# EAGLE design ODGIRON-v1.0-F4x1-0410 (EAGLE 9.6.0)
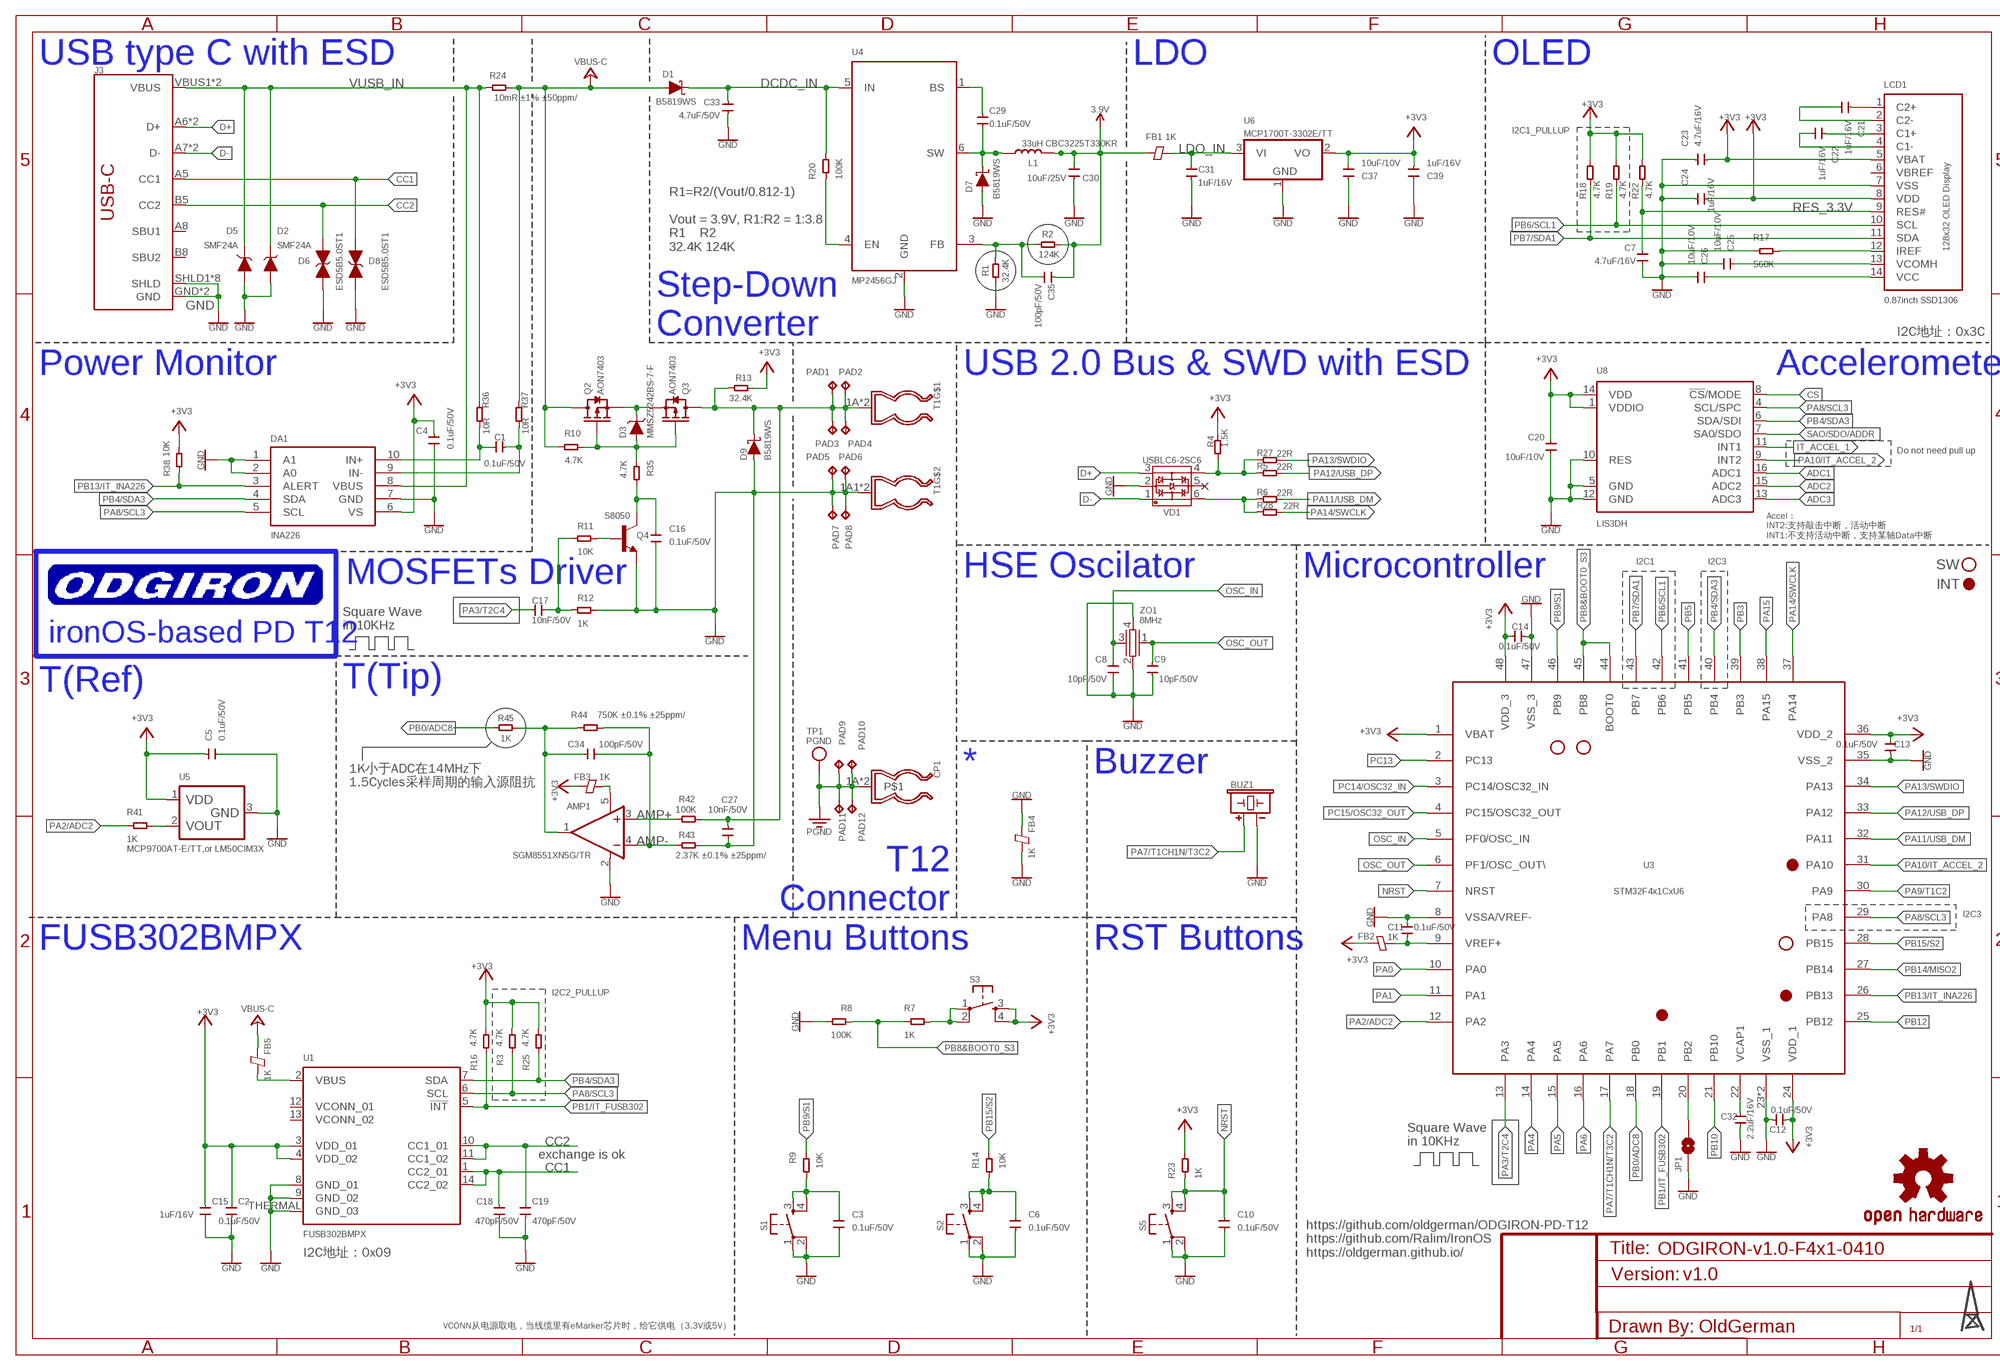
[diagram p0: schematic, sheet 1, part 1 of 2]
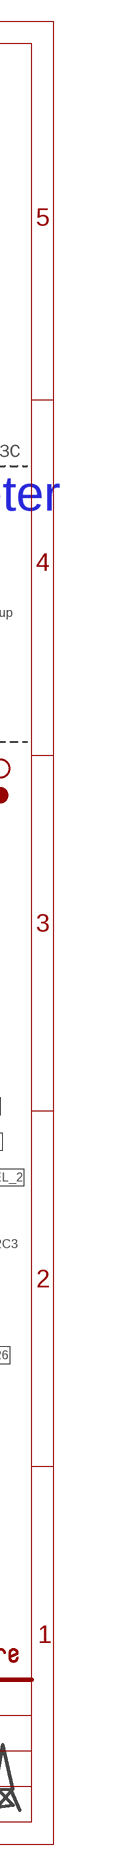
[diagram p1: schematic, sheet 1, part 2 of 2]

## Parts
AMP1  SGM8551XN5G/TR  AMP_SIMGLEN  [SOT23-5]
BUZ1  BUZZERBUZZER_5020  [BUZZER_5020]
C1  0.1uF/50V  SEEED_CAP-0603  [C0603]
C2  0.1uF/50V  SEEED_CAP-0603  [C0603]
C3  0.1uF/50V  SEEED_CAP-0603  [C0603]
C4  0.1uF/50V  SEEED_CAP-0603  [C0603]
C5  0.1uF/50V  SEEED_CAP-0603  [C0603]
C6  0.1uF/50V  SEEED_CAP-0603  [C0603]
C7  4.7uF/16V  SEEED_CAP-0603  [C0603]
C8  10pF/50V  SEEED_CAP-0603  [C0603]
C9  10pF/50V  SEEED_CAP-0603  [C0603]
C10  0.1uF/50V  SEEED_CAP-0603  [C0603]
C11  0.1uF/50V  SEEED_CAP-0603  [C0603]
C12  0.1uF/50V  SEEED_CAP-0603  [C0603]
C13  0.1uF/50V  SEEED_CAP-0603  [C0603]
C14  0.1uF/50V  SEEED_CAP-0603  [C0603]
C15  1uF/16V  SEEED_CAP-0603  [C0603]
C16  0.1uF/50V  SEEED_CAP-0603  [C0603]
C17  10nF/50V  SEEED_CAP-0603  [C0603]
C18  470pF/50V  SEEED_CAP-0603  [C0603]
C19  470pF/50V  SEEED_CAP-0603  [C0603]
C20  10uF/10V  SEEED_CAP-0603  [C0603]
C21  1uF/16V  SEEED_CAP-0603  [C0603]
C22  1uF/16V  SEEED_CAP-0603  [C0603]
C23  4.7uF/16V  SEEED_CAP-0603  [C0603]
C24  1uF/16V  SEEED_CAP-0603  [C0603]
C25  10uF/10V  SEEED_CAP-0603  [C0603]
C26  10uF/10V  SEEED_CAP-0603  [C0603]
C27  10nF/50V  SEEED_CAP-0603  [C0603]
C29  0.1uF/50V  SEEED_CAP-0603  [C0603]
C30  10uF/25V  SEEED_CAP-0805  [C0805]
C31  1uF/16V  SEEED_CAP-0603  [C0603]
C32  2.2uF/16V  SEEED_CAP-0603  [C0603]
C33  4.7uF/50V  SEEED_CAP-0805  [C0805]
C34  100pF/50V  SEEED_CAP-0603  [C0603]
C35  100pF/50V  SEEED_CAP-0603  [C0603]
C37  10uF/10V  SEEED_CAP-0603  [C0603]
C39  1uF/16V  SEEED_CAP-0603  [C0603]
CP1  FUSE_CLIPS_01  [FUSE_CLIPS_01]
D1  B5819WS  DIODE_SCHOTTKYSOD323  [SOD-323]
D2  SMF24A  DIODE-TVS_UNIDIRECTIONALSOD-123  [SOD-123]
D3  MMSZ5242BS-7-F  DIODE_ZENERSOD-323  [SOD-323]
D5  SMF24A  DIODE-TVS_UNIDIRECTIONALSOD-123  [SOD-123]
D6  ESD5B5.0ST1  DIODE-TVS_BI−DIRECTIONALSOD-523  [SOD-523]
D7  B5819WS  DIODE_SCHOTTKYSOD323  [SOD-323]
D8  ESD5B5.0ST1  DIODE-TVS_BI−DIRECTIONALSOD-523  [SOD-523]
D9  B5819WS  DIODE_SCHOTTKYSOD323  [SOD-323]
DA1  INA226  [MSOP10]
FB1  1K  FERRITE-BEAD-0603  [F0603]
FB2  1K  FERRITE-BEAD-0603  [F0603]
FB3  1K  FERRITE-BEAD-0603  [F0603]
FB4  1K  FERRITE-BEAD-0603  [F0603]
FB5  1K  FERRITE-BEAD-0603  [F0603]
J3  USB_C_LONG-SYMBOL2-LAYER  [USB-C-16P]
JP1  JUMPER-SMT_2_NO_SILK  [SMT-JUMPER_2_NO_SILK]
L1  33uH CBC3225T330KR  INDUCTOR3225  [SMD,3.2X2.5X2.5MM]
LCD1  0.87inch SSD1306  0.87INCH_OLED_128X32_SSD1306  [0.87INCH_128X32_OLED_SSD1306]
LOGO1  OSHW-LOGONO_SILK  [DUMMY]
PAD1  PADTP16SQ  [TP16SQ]
PAD2  PADTP16SQ  [TP16SQ]
PAD3  PADTP16SQ  [TP16SQ]
PAD4  PADTP16SQ  [TP16SQ]
PAD5  PADTP16SQ  [TP16SQ]
PAD6  PADTP16SQ  [TP16SQ]
PAD7  PADTP16SQ  [TP16SQ]
PAD8  PADTP16SQ  [TP16SQ]
PAD9  PADTP16SQ  [TP16SQ]
PAD10  PADTP16SQ  [TP16SQ]
PAD11  PADTP16SQ  [TP16SQ]
PAD12  PADTP16SQ  [TP16SQ]
Q2  AON7403  MOSFET-P-AON7403  [DFN8P-0.65-3X3X0.8MM]
Q3  AON7403  MOSFET-P-AON7403  [DFN8P-0.65-3X3X0.8MM]
Q4  S8050  TRANS_NPN-MMBT2222AL  [SOT23-3]
R1  32.4K  SEEED_RES-0603  [R0603]
R2  124K  SEEED_RES-0603  [R0603]
R3  4.7K  SEEED_RES-0603  [R0603]
R4  1.5K  SEEED_RES-0603  [R0603]
R5  22R  SEEED_RES-0603  [R0603]
R6  22R  SEEED_RES-0603  [R0603]
R7  1K  SEEED_RES-0603  [R0603]
R8  100K  SEEED_RES-0603  [R0603]
R9  10K  SEEED_RES-0603  [R0603]
R10  4.7K  SEEED_RES-0603  [R0603]
R11  10K  SEEED_RES-0603  [R0603]
R12  1K  SEEED_RES-0603  [R0603]
R13  32.4K  SEEED_RES-0603  [R0603]
R14  10K  SEEED_RES-0603  [R0603]
R16  4.7K  SEEED_RES-0603  [R0603]
R17  560K  SEEED_RES-0603  [R0603]
R18  4.7K  SEEED_RES-0603  [R0603]
R19  4.7K  SEEED_RES-0603  [R0603]
R20  100K  SEEED_RES-0603  [R0603]
R22  4.7K  SEEED_RES-0603  [R0603]
R23  1K  SEEED_RES-0603  [R0603]
R24  10mR ±1% ±50ppm/℃  SEEED_RES-1206  [R1206]
R25  4.7K  SEEED_RES-0603  [R0603]
R27  22R  SEEED_RES-0603  [R0603]
R28  22R  SEEED_RES-0603  [R0603]
R35  4.7K  SEEED_RES-0603  [R0603]
R36  10R  SEEED_RES-0603  [R0603]
R37  10R  SEEED_RES-0603  [R0603]
R38  10K  SEEED_RES-0603  [R0603]
R41  1K  SEEED_RES-0603  [R0603]
R42  100K  SEEED_RES-0603  [R0603]
R43  2.37K ±0.1% ±25ppm/℃  SEEED_RES-0603  [R0603]
R44  750K ±0.1% ±25ppm/℃  SEEED_RES-0603  [R0603]
R45  1K  SEEED_RES-0603  [R0603]
S1  TAC_SWITCHSMD  [TACTILE_SWITCH_SMD]
S2  TAC_SWITCHSMD  [TACTILE_SWITCH_SMD]
S3  TAC_SWITCHSMD  [TACTILE_SWITCH_SMD]
S5  TAC_SWITCHSMD  [TACTILE_SWITCH_SMD]
T1  HAKKO_T12_K-TYPE_WITH_FUSE_CLIPS_X2  [HAKKO_T12_K-TYPE_WITH_FUSE_CLIPS_X2]
TP1  PGND  TESTPOINTROUND2MM  [TESTPOINT_ROUND_2MM]
U1  FUSB302BMPX  FUSB302  [QFN14-2.5X2.5MM]
U3  STM32F4x1CxU6  STM32F4_QFN48  [QFN48_7X7MM_0.5MM]
U4  MP2456GJ  MP2456  [SOT23-6]
U5  MCP9700AT-E/TT,or LM50CIM3X  MCP9700  [SOT23-3@1]
U6  MCP1700T-3302E/TT  MCP1700  [SOT23-3]
U8  LIS3DH  [LGA-16-3X3]
VD1  USBLC6-2SC6  USBLC6-2SOT23-6  [SOT23-6]
ZO1  8MHz  3225_CRYSTALL  [3.2X2.5_KX-7]

## Nets
3.9V: C30.1 C35.1 FB1.1 L1.2 R2.1
+3V3: C2.1 C4.1 C5.1 C12.2 C13.2 C14.2 C15.1 C20.2 C23.2 C24.2 C37.2 C39.2 DA1.6(VS) FB2.2 FB3.2 LCD1.5(VBAT) LCD1.8(VDD) R3.1 R4.2 R13.2 R16.1 R18.2 R19.2 R22.2 R23.2 R25.1 R38.1 S3.3 S3.4 U1.3(VDD_01) U1.4(VDD_02) U3.1(VBAT) U3.24(VDD_1) U3.36(VDD_2) U3.48(VDD_3) U5.1(VDD) U6.2(VO) U8.1(VDDIO) U8.14(VDD)
ADC1: U8.16(ADC1)
ADC2: U8.15(ADC2)
ADC3: U8.13(ADC3)
AMP+: AMP1.3(+IN) R42.1
AMP-: AMP1.4(-IN) C34.2 R43.1 R44.2
BS: C29.1 U4.1(BS)
CC1: C18.1 D8.K(C) J3.A5(CC1) U1.1(CC2_01) U1.14(CC2_02)
CC2: C19.1 D6.K(C) J3.B5(CC2) U1.10(CC1_01) U1.11(CC1_02)
CS: U8.8(!CS!/MODE)
D+: J3.A6(D+) J3.B6(D+) VD1.3
D-: J3.A7(D-) J3.B7(D-) VD1.1
DCDC_IN: C33.1 D1.C R20.2 U4.5(IN)
EN: R20.1 U4.4(EN)
GND: AMP1.2(V-) BUZ1.-(LEAD-) C2.2 C3.2 C4.2 C5.2 C6.2 C7.2 C8.1 C9.1 C10.2 C11.1 C12.1 C13.1 C14.1 C15.2 C16.1 C18.2 C19.2 C20.1 C23.1 C24.1 C25.2 C26.2 C27.2 C30.2 C31.1 C32.2 C33.2 C37.1 C39.1 D2.A D5.A D6.A D7.A D8.A D9.A DA1.1(A1) DA1.2(A0) DA1.7(GND) FB4.1 FB4.2 J3.GND J3.GND2(GND) J3.SHLD1(SHLD) J3.SHLD2(SHLD) J3.SHLD3(SHLD) J3.SHLD4(SHLD) J3.SHLD5(SHLD) J3.SHLD6(SHLD) J3.SHLD7(SHLD) J3.SHLD8(SHLD) JP1.1 LCD1.7(VSS) PAD5.TP PAD6.TP PAD7.TP PAD8.TP Q4.2(E) R1.1 R8.2 R12.1 R17.1 R43.2 S1.1 S1.2 S2.1 S2.2 S5.1 S5.2 T1.1A1 T1.1B1 U1.8(GND_01) U1.9(GND_02) U1.THERMAL(GND_03) U3.8(VSSA/VREF-) U3.23(VSS_1) U3.35(VSS_2) U3.47(VSS_3) U3.P$1(VSS_1) U4.2(GND) U5.3(GND) U6.1(GND) U8.5(GND) U8.10(RES) U8.12(GND) VD1.2 ZO1.2 ZO1.4
IT_ACCEL_1: U8.11(INT1)
LDO_IN: C31.2 FB1.2 U6.3(VI)
N$1: R4.1 R5.1 R27.1 VD1.4
N$2: R7.2 S3.1 S3.2
N$3: D3.C Q2.1(S) Q2.2(S) Q2.3(S) Q3.1(S) Q3.2(S) Q3.3(S)
N$4: C21.1 LCD1.1(C2+)
N$5: D3.A Q2.4(G) Q3.4(G) R10.2 R35.1
N$6: C22.1 LCD1.3(C1+)
N$7: C11.2 FB2.1 U3.9(VREF+)
N$8: C3.1 R9.2 S1.3 S1.4
N$11: C21.2 LCD1.2(C2-)
N$12: C6.1 R14.2 S2.3 S2.4
N$13: C22.2 LCD1.4(C1-)
N$14: C25.1 LCD1.13(VCOMH)
N$15: LCD1.12(IREF) R17.2
N$16: C26.1 LCD1.14(VCC)
N$17: Q4.1(B) R11.1
N$18: C35.2 R1.2 R2.2 U4.3(FB)
N$19: C16.2 Q4.3(C) R35.2
N$20: C17.1 R11.2 R12.2
N$21: AMP1.5(V+) FB3.1
N$22: R6.1 R28.1 VD1.6
N$23: FB5.1 U1.2(VBUS)
N$24: JP1.2 U3.20(PB2)
N$30: C1.1 DA1.10(IN+) R36.1
N$32: C1.2 DA1.9(IN-) R37.1
N$35: R41.2 U5.2(VOUT)
NRST: C10.1 R23.1 S5.3 S5.4 U3.7(NRST)
OSC_IN: C8.2 U3.5(PF0/OSC_IN) ZO1.3
OSC_OUT: C9.2 U3.6(PF1/OSC_OUT\) ZO1.1
OUT: AMP1.1(OUT) C34.1 R44.1 R45.2
PA0: U3.10(PA0)
PA1: U3.11(PA1)
PA2/ADC2: R41.1 U3.12(PA2)
PA3/T2C4: C17.2 U3.13(PA3)
PA4: U3.14(PA4)
PA5: U3.15(PA5)
PA6: U3.16(PA6)
PA7/T1CH1N/T3C2: BUZ1.+(LEAD+) U3.17(PA7)
PA8/SCL3: DA1.5(SCL) R3.2 U1.6(SCL) U3.29(PA8) U8.4(SCL/SPC)
PA9/T1C2: U3.30(PA9)
PA10/IT_ACCEL_2: U3.31(PA10) U8.9(INT2)
PA11/USB_DM: R6.2 U3.32(PA11)
PA12/USB_DP: R5.2 U3.33(PA12)
PA13/SWDIO: R27.2 U3.34(PA13)
PA14/SWCLK: R28.2 U3.37(PA14)
PA15: U3.38(PA15)
PB0/ADC8: R45.1 U3.18(PB0)
PB1/IT_FUSB302: R16.2 U1.5(!INT) U3.19(PB1)
PB3: U3.39(PB3)
PB4/SDA3: DA1.4(SDA) R25.2 U1.7(SDA) U3.40(PB4) U8.6(SDA/SDI)
PB5: U3.41(PB5)
PB6/SCL1: LCD1.10(SCL) R19.1 U3.42(PB6)
PB7/SDA1: LCD1.11(SDA) R18.1 U3.43(PB7)
PB8&BOOT0_S3: R7.1 R8.1 U3.44(BOOT0) U3.45(PB8)
PB9/S1: R9.1 U3.46(PB9)
PB10: U3.21(PB10)
PB12: U3.25(PB12)
PB13/IT_INA226: DA1.3(ALERT) R38.2 U3.26(PB13)
PB14/MISO2: U3.27(PB14)
PB15/S2: R14.1 U3.28(PB15)
PC13: U3.2(PC13)
PC14/OSC32_IN: U3.3(PC14/OSC32_IN)
PC15/OSC32_OUT: U3.4(PC15/OSC32_OUT)
PGND: CP1.1A CP1.1B PAD9.TP PAD10.TP PAD11.TP PAD12.TP TP1.P$1
RES_3.3V: C7.1 LCD1.9(RES#) R22.1
SAO/SDO/ADDR: U8.7(SA0/SDO)
SW: C29.2 D7.C L1.1 U4.6(SW)
T12+: C27.1 D9.C PAD1.TP PAD2.TP PAD3.TP PAD4.TP Q3.5(D) Q3.6(D) Q3.7(D) Q3.8(D) Q3.9(D) R13.1 R42.2 T1.1A T1.1B
VBUS-C: D1.A FB5.2 Q2.5(D) Q2.6(D) Q2.7(D) Q2.8(D) Q2.9(D) R10.1 R24.1 R37.2
VCAP1: C32.1 U3.22(VCAP1)
VUSB_IN: D2.C(K) D5.C(K) DA1.8(VBUS) J3.VBUS1(VBUS) J3.VBUS2(VBUS) R24.2 R36.2
Unconnected: J3.A8(SBU1) J3.B8(SBU2) U1.12(VCONN_01) U1.13(VCONN_02) VD1.5

## Notes on the sheet
- USB type C with ESD | LDO | OLED
- I2C1_PULLUP
- R1=R2/(Vout/0.812-1)
  
  Vout = 3.9V, R1:R2 = 1:3.8
  R1    R2
  32.4K 124K
- Step-Down
  Converter
- I2C地址：0x3C
- Power Monitor | USB 2.0 Bus & SWD with ESD | Accelerometer
- Do not need pull up
- Accel：
  INT2:支持敲击中断，活动中断
  INT1:不支持活动中断，支持某轴Data中断
- I2C1 | I2C3 | SW
- MOSFETs Driver | HSE Oscilator | Microcontroller
- INT
- Square Wave
  in 10KHz
- ironOS-based PD T12
- T(Ref) | T(Tip)
- * | Buzzer
- 1K小于ADC在14MHz下
  1.5Cycles采样周期的输入源阻抗
- T12
  Connector
- I2C3
- FUSB302BMPX | Menu Buttons | RST Buttons
- I2C2_PULLUP
- Square Wave
  in 10KHz
- exchange is ok
- FUSB302 | ACCEL+2 | SW | SW | ACCEL_1 | INA226 | SW
- I2C地址：0x09
- https://github.com/oldgerman/ODGIRON-PD-T12
  https://github.com/Ralim/IronOS
  https://oldgerman.github.io/
- F103C8,F411: 0, 1, 2, 3, 4, 5-9, 10-15
  F072:0-1, 2-3, 4-15
- v1.0
- FUSB302 | ACCEL_2 | SW | SW | ACCEL_1 | INA226 | SW
- OldGerman
- VCONN从电源取电，当线缆里有eMarker芯片时，给它供电（3.3V或5V）

## Power pins joined to a net without a drawn wire
VBREF: LCD1.6(VBREF)

## Library data of the parts
AMP1 = TS100:AMP_SIMGLE: Rail-to-Rail Operational Amplifiers Single-Supply, MicroAmplifier(TM) Series; MPN: OPA340NA/3KG4; OC_FARNELL: 1234805; OC_NEWARK: 13M5177
BUZ1 = TS100:BUZZER
C1-C27 C29-C35 C37 C39 = TS100:SEEED_CAP: Ceramic Capacitors
CP1 = TS100:FUSE_CLIPS_01: FUSE 5 x 20 mm
D1 D7 D9 = TS100:DIODE_SCHOTTKY
D2 D5 = TS100:DIODE-TVS_UNIDIRECTIONAL
D3 = TS100:DIODE_ZENER
D6 D8 = TS100:DIODE-TVS_BI−DIRECTIONAL
DA1 = TS100:INA226: Lithium-Polymer/Lithium-Ion Battery Charger [Part No.] Microchip MCP73833 MSOP10 (tube only): Digikey: MCP73833T-AMI/UN or MCP73833-FCI/UN-ND Mouser: 579-MCP73833-AMI/UN DFN10 (tape): Digikey: Note Chips ending in 'AMI' have no timer, and chips ending in 'FCI' have a 6-hour timer that will end the charge sequence after 6 horus regqrdless of current charge level.
FB1-FB5 = TS100:FERRITE-BEAD
J3 = FUSB302:USB_C_LONG-SYMBOL: USB Type C 16Pin Connector Super Speed pins not available on the 16-pin purely SMD connector so this part is best for USB 2.0 implementations. D1 and D2 are tied together enabling D+/- no matter which way the cable is plugged into the connector. The two channel configuration pins (CC1/2) are exposed. These are normally connected to ground via 5.1k resistors but can be reconfigured for high current/high power applications.; PROD_ID: CONN-14122
JP1 = TS100:JUMPER-SMT_2_NO: Normally open jumper This jumper has two pads in close proximity to each other. Apply solder to close the connection. Round pads are easier to solder for beginners, but are a lot larger. SparkFun Product that uses the round pads: SparkFun EL Sequencer <https://www.sparkfun.com/products/12781>
L1 = TS100:INDUCTOR
LCD1 = TS100:0.87INCH_OLED_128X32_SSD1306: 128x32 I2C 0.91" Monochrome OLED Display
LOGO1 = SparkFun-Aesthetics:OSHW-LOGO: Open-Source Hardware (OSHW) Logo This logo indicates the piece of hardware it is found on incorporates a OSHW license and/or adheres to the definition of open source hardware found here: http://freedomdefined.org/OSHW
PAD1-PAD12 = TS100:PAD: Test pad
Q2 Q3 = TS100:MOSFET-P
Q4 = SparkFun-DiscreteSemi:TRANS_NPN: NPN transistor Current controlled devices typically used to amplify current or used as a switch. BC547 - COM-08928 <http://www.sparkfun.com/products/8928> (TO-92 45V 100mA) (1.Collector 2.Base 3.Emitter) 2N3904 - COM-00521 <http://www.sparkfun.com/products/521> (TO-92 40V 200mA) (1.Emitter 2.Base 3.Collector) P2N2222A - COM-12852 <http://www.sparkfun.com/products/12852> (TO-92 40V 600mA) (1.Collector 2.Base 3.Emitter); PROD_ID: TRANS-08049; VALUE: 600mA/40V
R1-R14 R16-R20 R22-R25 R27 R28 R35-R38 R41-R45 = TS100:SEEED_RES
S1-S3 = TS100:TAC_SWITCH: Momentary Switch Button commonly used for reset or general input. Spark Fun Electronics SKU : COM-00097
S5 = untitled:TAC_SWITCH: Momentary Switch Button commonly used for reset or general input. Spark Fun Electronics SKU : COM-00097
T1 = T12_FUSE_CLIPS:HAKKO_T12_K-TYPE_WITH_FUSE_CLIPS_X2
TP1 = microbuilder:TESTPOINT: Test Point Various test points for characterisation and PCB testing TESTPOINT_SMT - Compact Surface Mount Test Point [Digikey: 5016KTR-ND]
U1 = FUSB302:FUSB302: Espressif ESP8266 WiFi/Microcontroller SoC The ESP8266 WiFi Module is a self contained SOC with integrated TCP/IP protocol stack that can give any microcontroller access to your WiFi network. The ESP8266 is capable of either hosting an application or offloading all Wi-Fi networking functions from another application processor. SparkFun Products WiFi Module ESP8266 <https://www.sparkfun.com/products/13678> (WRL-13678) SparkFun ESP8266 Thing <https://www.sparkfun.com/products/13231> (WRL-13231) SparkFun WiFi Shield - ESP8266 <https://www.sparkfun.com/products/13287> (WRL-13287) SparkFun ESP8266 Thing - Dev Board <https://www.sparkfun.com/products/13711> (WRL-13711) SparkFun Blynk Board - ESP8266 <https://www.sparkfun.com/products/13794> (WRL-13794); PROD_ID: IC-12452
U3 = STM32:STM32F4_QFN48
U4 = TS100:MP2456
U5 = TS100:MCP9700
U6 = TS100:MCP1700
U8 = SparkFun-Sensors:LIS3DH: ST Microelectronics LIS3DH 3-Axis ±2/4/8/16g SPI/I2C Accelerometer The LIS3DH is a three axis MEMS linear accelerometer in the "nano" family. It has a digital I2C/SPI serial interface which makes it ideal for using in embedded applications. The device also features ultra low-power operational modes that allow advanced power saving and smart sleep to wake-up functions, built in detections with interrupts, and auxiliary ADC inputs Datasheet-XXXX <http://www.sparkfun.com/datasheets/Sensors/Accelerometer/LIS3DH.pdf> SparkFun Products SparkFun Triple Axis Accelerometer Breakout - LIS3DH <https://www.sparkfun.com/products/10345> (SEN-XXXXX) Triple Axis Accelerometer - LIS3DH <https://www.sparkfun.com/products/9755> (SEN-XXXXX); PROD_ID: IC-13419; SF_ID: N/A
VD1 = ESD-protection:USBLC6-2
ZO1 = DIP:3225_CRYSTALL

## Board
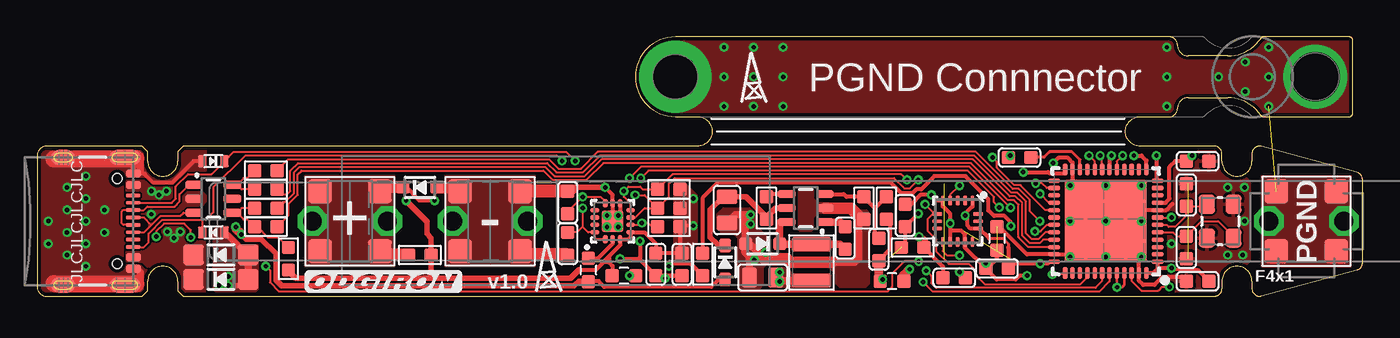
[diagram p2: board, top side]
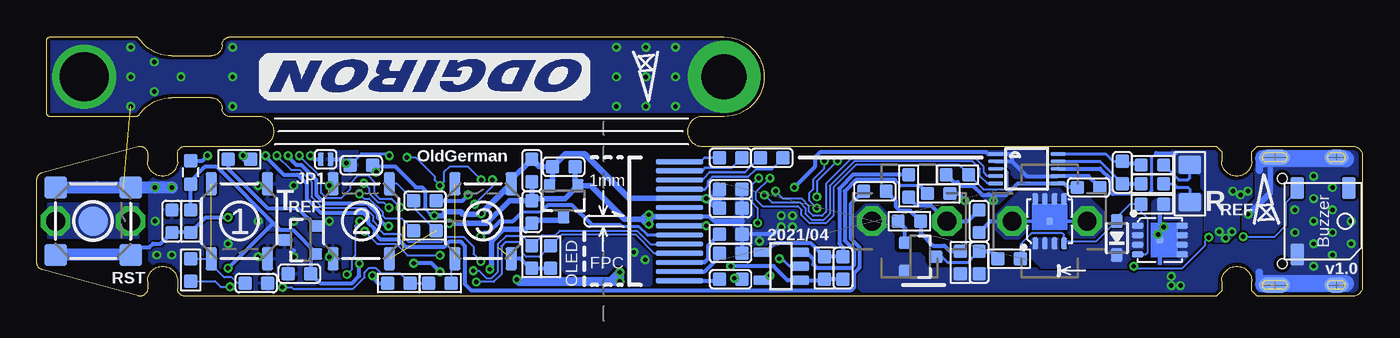
[diagram p3: board, bottom side, seen from below]

Size 89.79 x 17.56 mm. Coordinates in mm from the lower left corner, seen from the top.
Outline: 9.53,9.78 9.53,9.14 arc-180 7.49,9.14 7.49,9.78 7.11,10.16 0.64,10.16 arc90 0,9.52 0,0.63 arc90 0.64,0 7.11,0 7.49,0.38 7.49,1.02 arc-180 9.53,1.02 9.53,0.38 9.91,0 79.76,0 arc90 80.26,0.51 80.26,1.02 arc-180 82.3,1.02 82.3,0.51 arc105 82.94,0.02 89.41,1.78 arc75 89.79,2.29 89.79,7.87 arc75 89.41,8.38 82.94,10.14 arc105 82.3,9.65 82.3,9.14 arc-180 80.26,9.14 80.26,9.65 arc90 79.76,10.16 74.73,10.16 arc-90 73.73,11.16 arc-90 74.73,12.16 76.7,12.16 arc90 77.25,12.71 arc-90 78,13.45 80.67,13.45 arc-56 82.88,12.27 arc56 83.09,12.16 88.88,12.16 arc90 89.13,12.41 89.13,17.31 arc90 88.88,17.56 83.09,17.56 arc56 82.88,17.45 arc-56 80.67,16.27 78,16.27 arc-90 77.25,17.01 arc90 76.7,17.56 43.23,17.56 arc180 43.23,12.16 44.73,12.16 arc-90 45.73,11.16 arc-90 44.73,10.16 9.91,10.16 9.53,9.78
Copper layers (1*16): Top 0.035mm / dielectric 1.5mm / Bottom 0.035mm
Design rules "default *": minimum track width 5mil, minimum drill 0.3mm, track to track 5mil, track to pad 6mil, pad to pad 6mil, via to via 6mil, smd to smd 5mil, copper to edge 10mil, drill to drill 10mil, minimum pad ring 10mil, minimum via ring 6mil, stop-mask expansion 1mil, vias tented up to drill 20mil, thermal gap 8mil
tRestrict: 9 lines
bRestrict: 7 lines

### Footprints (pad centres in the part's own frame; a part is rotated, then mirrored left to right if it is on the bottom)
SOT23-5 = smd 0.6 x 1.2: 1 -0.95,-1.306; 2 0,-1.306; 3 0.95,-1.306; 4 0.95,1.306; 5 -0.95,1.306
BUZZER_5020 = smd 1.5 x 0.9: + -2.25,-1.75; - 2.25,-1.75; NC -2.25,1.75
C0603 = smd 0.889 x 0.889: 1 -0.762,0; 2 0.762,0
C0805 = smd 1.016 x 1.397: 1 -0.889,0; 2 0.889,0
FUSE_CLIPS_01 = drill 1.27 pad 2 octagon: 1A -2.54,0; 1B 2.54,0
SOD-323 = smd 0.9 x 0.8: A 1.15,0; C -1.15,0
SOD-123 = smd 1.4 x 1.4: A 1.85,0; C -1.85,0
SOD-523 = smd 0.8 x 0.6: A 0,-0.75; K 0,0.75
MSOP10 = smd 0.25 x 1: 1 -1,-2.113; 2 -0.5,-2.113; 3 0,-2.113; 4 0.5,-2.113; 5 1,-2.113; 6 1,2.113; 7 0.5,2.113; 8 0,2.113; 9 -0.5,2.113; 10 -1,2.113
F0603 = smd 0.889 x 0.889: 1 -0.8,0; 2 0.8,0
USB-C-16P = smd 0.28 x 1: A5 -1.25,-0.34; A6 -0.25,-0.34; A7 0.25,-0.34; A8 1.25,-0.34; B5 1.75,-0.34; B6 0.75,-0.34; B7 -0.75,-0.34; B8 -1.75,-0.34 | smd 0.56 x 1: GND -3.225,-0.34; GND2 3.225,-0.34; VBUS1 -2.45,-0.34; VBUS2 2.45,-0.34 | smd 1 x 2.1: SHLD1 -4.32,-0.915; SHLD2 4.32,-0.915 | smd 1 x 2.1 bottom: SHLD3 -4.32,-0.915; SHLD4 4.32,-0.915 | smd 1 x 1.6: SHLD5 -4.32,-5.095; SHLD8 4.32,-5.095 | smd 1 x 1.6 bottom: SHLD6 -4.32,-5.095; SHLD7 4.32,-5.095 | hole 0.65: -2.89,-1.445; 2.89,-1.445
SMT-JUMPER_2_NO_SILK = smd 0.406 x 0.889: 1 -0.33,0; 2 0.33,0
SMD,3.2X2.5X2.5MM = smd 0.95 x 2.7: 1 1.225,0; 2 -1.225,0
0.87INCH_128X32_OLED_SSD1306 = smd 3.2 x 0.35: 1 -2.888,-4.03; 2 -2.888,-3.41; 3 -2.888,-2.79; 4 -2.888,-2.17; 5 -2.888,-1.55; 6 -2.888,-0.93; 7 -2.888,-0.31; 8 -2.888,0.31; 9 -2.888,0.93; 10 -2.888,1.55; 11 -2.888,2.17; 12 -2.888,2.79; 13 -2.888,3.41; 14 -2.888,4.03
TP16SQ = smd 1.6 x 1.6: TP 0,0
DFN8P-0.65-3X3X0.8MM = smd 0.8 x 0.4: 1 -1.5,0.975; 2 -1.5,0.325; 3 -1.5,-0.325; 4 -1.5,-0.975; 5 1.5,-0.975; 6 1.5,-0.325; 7 1.5,0.325; 8 1.5,0.975 | smd 0.508 x 0.508: 9 0,0
SOT23-3 = smd 0.8 x 0.9: 1 -0.95,-1; 2 0.95,-1; 3 0,1.1
R0603 = smd 0.889 x 0.889: 1 -0.762,0; 2 0.762,0
R1206 = smd 1.27 x 1.524: 1 -1.27,0; 2 1.27,0
TACTILE_SWITCH_SMD = smd 1.524 x 0.762: 1 -2.54,1.905; 2 2.54,1.905; 3 -2.54,-1.905; 4 2.54,-1.905
TACTILE_SWITCH_SMD' = smd 1.524 x 1.524: 1 -2.54,2.286; 2 2.54,2.286; 3 -2.54,-2.286; 4 2.54,-2.286
HAKKO_T12_K-TYPE_WITH_FUSE_CLIPS_X2 = drill 1.27 pad 2 octagon: 1A 6.96,0; 1A1 16.46,0; 1B 12.04,0; 1B1 21.54,0
TESTPOINT_ROUND_2MM = smd 2 x 2: P$1 0,0
QFN14-2.5X2.5MM = smd 0.58 x 0.3: 1 -1.215,0.5; 2 -1.215,0; 3 -1.215,-0.5; 8 1.215,-0.5; 9 1.215,0; 10 1.215,0.5 | smd 0.3 x 0.58: 4 -0.75,-1.215; 5 -0.25,-1.215; 6 0.25,-1.215; 7 0.75,-1.215; 11 0.75,1.215; 12 0.25,1.215; 13 -0.25,1.215; 14 -0.75,1.215 | smd 1.45 x 1.45: THERMAL 0,0
QFN48_7X7MM_0.5MM = smd 0.8 x 0.3: 1 -3.5,2.75; 2 -3.5,2.25; 3 -3.5,1.75; 4 -3.5,1.25; 5 -3.5,0.75; 6 -3.5,0.25; 7 -3.5,-0.25; 8 -3.5,-0.75; 9 -3.5,-1.25; 10 -3.5,-1.75; 11 -3.5,-2.25; 12 -3.5,-2.75; 25 3.5,-2.75; 26 3.5,-2.25; 27 3.5,-1.75; 28 3.5,-1.25; 29 3.5,-0.75; 30 3.5,-0.25; 31 3.5,0.25; 32 3.5,0.75; 33 3.5,1.25; 34 3.5,1.75; 35 3.5,2.25; 36 3.5,2.75 | smd 0.3 x 0.8: 13 -2.75,-3.5; 14 -2.25,-3.5; 15 -1.75,-3.5; 16 -1.25,-3.5; 17 -0.75,-3.5; 18 -0.25,-3.5; 19 0.25,-3.5; 20 0.75,-3.5; 21 1.25,-3.5; 22 1.75,-3.5; 23 2.25,-3.5; 24 2.75,-3.5; 37 2.75,3.5; 38 2.25,3.5; 39 1.75,3.5; 40 1.25,3.5; 41 0.75,3.5; 42 0.25,3.5; 43 -0.25,3.5; 44 -0.75,3.5; 45 -1.25,3.5; 46 -1.75,3.5; 47 -2.25,3.5; 48 -2.75,3.5 | smd 5.6 x 5.6: P$1 0,0
SOT23-6 = smd 0.55 x 1.2: 1 0.95,1.3; 2 0,1.3; 3 -0.95,1.3; 4 -0.95,-1.3; 5 0,-1.3; 6 0.95,-1.3
SOT23-3@1 = smd 0.8 x 0.9: 1 -0.95,-1; 2 0.95,-1; 3 0,1.1
LGA-16-3X3 = smd 0.7 x 0.28: 1 -1.4,1; 2 -1.4,0.5; 3 -1.4,0; 4 -1.4,-0.5; 5 -1.4,-1; 9 1.4,-1; 10 1.4,-0.5; 11 1.4,0; 12 1.4,0.5; 13 1.4,1 | smd 0.28 x 0.7: 6 -0.5,-1.4; 7 0,-1.4; 8 0.5,-1.4; 14 0.5,1.4; 15 0,1.4; 16 -0.5,1.4
3.2X2.5_KX-7 = smd 1.3 x 1.1: 1 -1.15,-0.9; 2 1.15,-0.9; 3 1.15,0.9; 4 -1.15,0.9

### Placement (x,y rotation side)
AMP1  39.37,2.03 90 bottom
BUZ1  2.67,5.08 270 bottom
C1  16.26,8.38 270 bottom
C2  41.91,2.16 270 top
C3  74.93,0.89 0 bottom
C4  18.54,7.37 0 bottom
C5  72.01,1.52 180 bottom
C6  63.5,6.48 0 bottom
C7  62.13,1.24 0 top
C8  77.85,3.3 90 top
C9  77.85,6.86 270 top
C10  80.65,5.08 90 bottom
C11  78.61,9.14 180 top
C12  67.82,8.86 0 bottom
C13  65.02,1.88 0 top
C14  78.61,1.02 0 top
C15  43.69,2.16 270 top
C16  25.96,2.29 90 bottom
C17  33.02,7.11 180 bottom
C18  35.94,3.56 270 top
C19  35.94,6.35 90 top
C20  58.8,5.46 270 top
C21  42.8,9.37 0 bottom
C22  40,9.37 0 bottom
C23  42.8,7.24 180 bottom
C24  42.8,5.97 180 bottom
C25  42.8,2.92 0 bottom
C26  42.8,1.14 0 bottom
C27  25.96,5.08 90 bottom
C29  54.74,3.94 270 top
C30  49.15,1.27 180 top
C31  56.26,5.72 270 bottom
C32  66.55,9.4 180 top
C33  46.74,5.84 270 top
C34  35.18,1.91 90 bottom
C35  57.02,3.17 90 top
C37  56.26,8.51 90 bottom
C39  54.1,8.76 180 bottom
CP1  85.98,5.08 0 top
D1  46.61,2.29 270 top
D2  12.45,1.14 0 top
D3  16.64,3.94 90 bottom
D5  12.45,2.79 0 top
D6  11.94,4.32 90 top
D7  49.15,3.56 180 top
D8  11.94,9.14 270 top
D9  25.93,7.37 0 top
DA1  22.73,8.64 270 bottom
FB1  57.91,1.02 0 top
FB2  79.38,8.38 270 bottom
FB3  39.75,1.4 180 top
FB4  65.02,3.91 90 top
FB5  37.34,1.78 270 top
J3  6.86,5.08 270 top
JP1  70.23,9.27 180 bottom
L1  52.45,2.29 90 top
LCD1  49.15,5.08 180 bottom
LOGO1  -0.38,-1.14 0 top
PAD1  19.18,7.11 0 top
PAD2  23.22,7.11 0 top
PAD3  19.18,3.05 0 top
PAD4  23.22,3.05 0 top
PAD5  28.65,7.11 0 top
PAD6  28.65,3.05 0 top
PAD7  32.72,7.11 0 top
PAD8  32.72,3.05 0 top
PAD9  88.01,3.05 0 top
PAD10  83.95,7.11 0 top
PAD11  83.95,3.05 0 top
PAD12  88.01,7.11 0 top
Q2  13.72,3.81 0 bottom
Q3  21.18,5.08 90 bottom
Q4  29.97,2.67 270 bottom
R1  56.01,5.97 90 top
R2  57.53,5.97 90 top
R3  42.8,5.97 180 top
R4  17.02,2.54 270 top
R5  15.49,5.97 0 top
R6  15.49,7.24 0 top
R7  62.48,0.89 0 bottom
R8  65.28,0.89 180 bottom
R9  79.38,1.78 90 bottom
R10  14.22,6.22 180 bottom
R11  30.68,5.08 0 bottom
R12  27.23,2.29 90 bottom
R13  25.93,2.79 0 top
R14  63.5,4.45 0 bottom
R16  42.8,4.7 180 top
R17  42.8,4.19 180 bottom
R18  54.99,2.67 270 bottom
R19  56.26,2.67 270 bottom
R20  49.4,5.97 270 top
R22  59.31,3.3 180 top
R23  79.38,5.08 90 bottom
R24  11.68,7.62 90 bottom
R25  42.8,7.24 180 top
R27  15.49,4.7 0 top
R28  15.49,8.51 0 top
R35  23.93,2.54 180 bottom
R36  14.22,8.89 0 bottom
R37  14.22,7.62 0 bottom
R38  27.43,8.23 0 bottom
R41  76.07,9.27 180 bottom
R42  28.7,6.96 0 bottom
R43  30.73,7.47 270 bottom
R44  36.45,1.91 90 bottom
R45  45.08,2.16 270 top
S1  76.07,5.08 270 bottom
S2  67.82,5.08 90 bottom
S3  59.56,5.08 90 bottom
S5  [TACTILE_SWITCH_SMD']  85.98,5.08 0 bottom
T1  11.68,5.08 0 top
TP1  85.98,5.08 0 bottom
U1  38.99,5.08 90 top
U3  72.39,5.08 180 top
U4  52.07,5.97 270 top
U5  71.91,3.81 90 bottom
U6  54.1,6.48 180 bottom
U8  62.36,5.08 270 top
U$3  [CREATIVE_COMMONS]  21.21,-10.29 0 top  (outside the outline)
VD1  11.94,6.6 90 top
ZO1  80.14,5.08 270 top

### Tracks (layer width: path | path; a pad name or v marks a point on that pad's centre or on a via)
3.9V  (via drill 0.3)
  Top 0.152: C30.1 50.04,1.25 v50.29,0.99
  Top 0.254: R2.1 57.78,4.95 57.78,3.17 C35.1
  Top 0.508: L1.2 50.25,1.06 C30.1 | v57.28,1.14 57.15,1.02 FB1.1
  Top 0.61: FB1.1 57.02,1.1 C35.1
  Bottom 0.61: v57.28,1.14 57.12,0.99 v50.29,0.99 v50.29,1.63 50.88,1.04
  pour Top (no thermals): 51.43,1.27 50.8,1.91 50.16,1.91 49.91,1.65 49.91,0.89 50.16,0.63 51.18,0.63 51.43,0.89
+3V3  (via drill 0.3)  (1 unrouted)
  Top 0.203: 78.61,1.78 76.96,1.78 | 64.49,3.92 65.43,3.92 65.79,3.57 65.79,3.3
  Top 0.254: 17.02,1.71 R4.2 | U3.36 68.57,2.33 68.45,2.21 v67.95,2.21 66.12,2.21 C13.2 65.79,3.3 | U3.24 69.64,8.45 69.49,8.3 68.61,8.3 68.5,8.41 v66.8,8.41 | v76.84,1.91 75.95,1.91 75.62,1.58 U3.48 | 76.96,1.78 v76.84,1.91 | 78.61,1.78 C14.2 | U3.1 75.89,1.91 v76.84,1.91 | 63.37,6.48 U8.1 63.36,6.08 62.87,5.59 v62.87,5.46 62.99,5.33 62.99,4.83 63.24,4.58 U8.14 63.83,4.58 64.49,3.92 | 43.56,4.38 R16.1 | U1.3 | U1.3 40.06,3.87 40.2,4.01 U1.4 41.14,4.33 41.91,3.56 C2.1 C15.1 43.56,3.05 R16.1 | 44.32,4.64 v44.45,4.77 | v44.45,4.77 44.45,4.7 | U1.3 39.5,3.47 38.73,2.71 | v44.45,4.77 43.63,4.77 R16.1 | v59.69,5.59 C20.2 58.8,3.56 R22.2 | 38.73,2.71 38.73,2.29 | 38.73,2.29 38.99,2.03 38.99,1.44 FB3.2 | 36.7,1.78 37.85,1.78 38.35,2.29 | 38.73,2.29 38.35,2.29 | 38.35,2.29 38.35,2.32 38.73,2.71
  Top 0.381: 17.02,1.71 17.53,1.21 26.67,1.21 | v24.99,6.48 26.42,5.05 26.42,4.22 26.7,3.94 R13.2 26.7,1.23 26.67,1.21 | 36.7,1.78 36.13,1.21 26.67,1.21
  Bottom 0.203: 63.5,5.93 63.14,5.57
  Bottom 0.254: 24.99,6.86 24.13,6.86 23.35,7.64 DA1.6 20.21,7.64 19.94,7.37 C4.1 | v67.95,2.21 67.95,1.37 68.43,0.89 70.61,0.89 C5.1 71.25,2.52 U5.1 70.91,2.96 72.44,4.49 73.32,4.49 73.79,4.95 | 73.79,4.95 v76.84,1.91 | C12.2 67.06,8.79 65.53,8.79 64.11,7.37 63.7,7.37 63.5,7.17 63.5,5.93 | LCD1.5 46.23,6.6 v44.45,6.6 43.81,5.97 C24.2 | R38.1 27.69,7.72 27.43,7.72 27.2,7.49 26.39,7.49 25.76,6.86 24.99,6.86 | 24.99,6.86 v24.99,6.48 | 73.79,4.95 77.32,8.48 77.32,8.5 77.58,8.76 78.41,8.76 79.38,7.8 FB2.2 R23.2 | LCD1.8 v44.45,4.77 | R18.2 R19.2 56.39,1.91 57.02,2.54 S3.3 | 63.14,5.57 63.03,5.46 v62.87,5.46
  Bottom 0.381: 57.66,8 S3.4 | S3.4 57.66,7.24 | v59.69,5.59 S3.4 | v59.69,5.59 59.69,5.7 | v62.87,5.46 62.36,5.46 62.1,5.72 61.09,5.72 60.91,5.54 59.74,5.54 v59.69,5.59 | LCD1.5 49.68,6.63 52.7,9.65 53.97,9.65 C39.2 | S3.4 57.66,7.87 C37.2 55.75,8.76 C39.2 | C39.2 54.86,7.75 55.05,7.56 U6.2
  Bottom 0.61: v44.45,6.6 43.69,6.6 43.56,6.73 C23.2 | v66.8,8.41 67.06,8.66 C12.2
  pour Top: 26.06,1.14 26.7,1.78 27.33,1.14
  pour Bottom (no thermals): 43.56,7.49 44.45,6.6 43.56,5.72 43.26,5.72 43.26,7.49
  pour Bottom: 24.1,6.86 24.69,6.3 25.22,6.3 25.76,6.86
  pour Top (no thermals): 43.87,7.57 44.6,6.83 44.6,2.92 44.27,2.59 43.23,2.59 43.23,7.57
  pour Bottom: 73.33,4.5 74.17,4.5 74.17,5.33
  pour Bottom (no thermals): 57.66,6.99 58.42,6.99 57.91,7.49 57.66,7.24
AMP+
  Bottom 0.203: 31.65,7.87 31.24,7.47 29.97,7.47
  Bottom 0.254: 31.65,7.87 34.29,7.87 35.05,7.11 35.05,3.76 34.45,3.16 34.45,2.1 34.65,1.91 36.93,1.91 37.18,2.16 37.18,2.51 37.65,2.98 AMP1.3 | R42.1 29.97,7.47
AMP-
  Bottom 0.254: R43.1 30.76,8.25 34.47,8.25 35.43,7.29 35.43,3.56 35.18,3.3 C34.2 R44.2 37.4,3.62 39.79,3.62 40.42,2.98 AMP1.4
BS
  Top 0.508: C29.1 54.42,5.02 U4.1
CC1  (via drill 0.3)
  Top 0.127: v36.45,9.17 35.84,9.78 13.32,9.78 D8.K 11.82,8.27 10.23,8.27 9.4,7.44 9.4,6.6 9.12,6.33 J3.A5 | C18.1 36.59,4.33 36.96,4.7 | U1.1 37.86,3.87 37.77,3.95 U1.14 37.33,4.33 36.96,4.7 | v36.96,5.97 36.96,4.7
  Bottom 0.127: v36.45,9.17 36.45,8.66 37.21,7.9 37.21,7.24 37.47,6.98 37.47,6.49 v36.96,5.97
CC2  (via drill 0.3)
  Top 0.127: J3.B5 7.23,3.33 7.54,3.65 7.54,4.24 8.46,5.16 11.17,5.16 | v35.56,9.17 35.2,9.52 14.1,9.52 11.94,7.37 11.94,5.68 11.42,5.16 11.17,5.16 | 37.77,6.73 v36.96,6.73 35.94,5.72 C19.1 | U1.11 37.77,6.73 | 37.77,6.73 38.18,6.73 38.49,6.42 U1.10 | 11.17,5.16 11.17,4.34 D6.K
  Bottom 0.127: v36.96,6.73 36.96,7.77 v35.56,9.17
D+
  Top 0.127: J3.A6 7.21,5.33 7.73,4.81 | J3.B6 7.25,4.33 7.73,4.81 | 7.73,4.81 8.36,5.44 9.7,5.44 9.92,5.65 VD1.3
  pour Top: 7.85,4.95 7.59,4.7 7.59,4.95
D-
  Top 0.127: J3.A7 5.84,4.83 5.71,4.95 5.71,5.72 5.84,5.84 6.51,5.84 J3.B7 7.23,5.83 7.47,6.08 9.3,6.08 9.65,6.43 9.65,6.91 10.3,7.55 VD1.1
DCDC_IN
  Top 0.381: D1.C 46.11,3.47 45.59,3.99 45.59,5.84 46.48,6.73 C33.1 48.03,6.73 49.4,5.36 | 49.4,5.36 R20.2 | U4.5 50.01,5.97 49.4,5.36
EN
  Top 0.254: U4.4 49.63,6.92 49.44,6.73 R20.1
GND  (via drill 0.3)  (11 unrouted)
  Top 0.127: 70.14,8.9 U3.23 | U1.THERMAL v38.61,4.7
  Top 0.254: D8.A 10.6,9.14 9.15,7.7 7.87,7.7 7.26,8.3 J3.GND | v38.48,7.37 38.99,6.86 U1.9 U1.THERMAL | v68.83,9.02 69.22,9.4 69.78,9.4 70.14,9.04 70.14,8.9 | C11.1 79.18,8.95 | ZO1.4 80.9,6.37 | ZO1.2 79.38,3.79 | C14.1 77.6,1.27 76.2,1.27 75.69,0.76 74.93,0.76 74.64,1.05 U3.47 74.64,2.5 v74.8,2.67 v74.8,5.08 74.8,5.83 | v69.98,2.67 69.81,2.83 U3.35 67.06,2.83 65.18,4.71 FB4.2 | U3.23 70.14,7.66 v69.98,7.49 v69.98,5.08 U3.P$1 v72.39,2.67 | 61.85,3.68 U8.10 61.86,4.45 | 61.86,4.45 v61.86,4.92 v61.85,4.93 61.85,5.59 61.36,6.08 U8.5 60.96,6.48 v60.58,6.86 59.85,6.86 59.21,6.22 C20.1 | U4.2 53.09,5.97 | U1.8 39.49,5.58 v39.37,5.46 | J3.SHLD3 6.98,9.4 | 61.86,4.45 62.61,4.45 62.86,4.2 U8.12 62.86,3.3 64.26,1.89 C13.1 | C13.1 65,1.14 66.29,1.14 66.55,1.4 v67.06,1.4 | C15.2 43.63,1.45 | v40.84,3.74 40.84,2.47 | 40.84,2.47 C2.2 | C2.2 42.09,1.22 v42.54,1.22 42.72,1.4 C15.2 | C15.2 C2.2 | 64.26,2 C13.1 | v64.26,2.24 C13.1 | C13.1 64.36,1.88 65.02,2.54 FB4.1 | 74.8,5.83 U3.8 76.48,5.83 76.91,6.25 | 74.8,5.83 v74.8,7.49 | v39.5,2.54 40.77,2.54 40.84,2.47 | C32.2 v65.91,9.52
  Top 0.381: D2.A 13.87,0.71 v12.95,0.71 | J3.GND 6.52,8.94 6.06,9.4 J3.SHLD3 3.69,9.4 | D6.A 14.21,2.79 | v38.48,7.37 38.48,7.26 38.37,7.38 36.56,7.38 | 36.56,7.38 36.2,7.38 C19.2 36.12,6.93 36.56,7.38
  Top 0.508: 14.21,2.79 D5.A D2.A | 55.63,5.46 55.63,2.54 55.37,2.29 53.85,2.29 | 6.98,1.62 6.98,0.76 | 6.98,9.4 6.98,8.54 | C33.2 47.3,5.52 v48.33,5.52 | C30.2 48.26,2.67 47.96,2.96 D7.A | D7.A 47.95,5.14 v48.33,5.52 | 49.25,2.54 48.24,3.56 D7.A | v48.33,5.52 48.4,5.52
  Top 0.61: 36.07,2.67 C18.2 | C7.2 v62.48,1.65
  Top 0.762: U4.2 55.12,5.97 55.63,5.46 | 53.85,2.29 51.05,2.29 50.8,2.54 49.25,2.54
  Top 0.8: D9.A 28.4,7.37 PAD5.TP
  Top 0.889: C19.2 PAD7.TP | C18.2 32.97,2.79
  Top 1.143: 6.68,0.84 6.66,0.86 1.13,0.86 | 6.68,9.32 6.66,9.3 1.13,9.3
  Bottom 0.203: v39.5,2.54 39.33,2.54 38.83,2.03 AMP1.2 | C12.1 67.79,9.65 66.04,9.65 v65.91,9.52
  Bottom 0.254: DA1.2 23.74,9.14 | 23.74,9.14 22.74,8.14 DA1.7 18.55,8.14 C4.2 | 23.74,9.14 23.74,9.61 23.77,9.64 DA1.1 25.35,9.64 25.5,9.78 36.7,9.78 37.08,9.4 37.08,8.76 v38.48,7.37 | 74.04,1.02 C3.2 | C12.1 68.73,9.02 v68.83,9.02 69.09,9.27 JP1.1 | 27.94,5.08 T1.1A1 | T1.1A1 29.24,6.17 30.2,6.17 R43.2 | v72.39,2.67 72.39,3.09 | T1.1A1 26.72,5.08 C27.2 | v39.37,4.7 39.88,4.19 40.84,4.19 | 40.84,4.19 R17.1 | R17.1 C25.2 | v40.84,3.74 40.84,4.19 | C23.1 C24.1 42.04,5.08 R17.1 | 43.81,5.08 43.93,5.08 44.24,5.39 LCD1.7 | v67.06,1.4 67.06,1.27 66.67,0.89 R8.2 | C6.2 60.96,6.48 v60.58,6.86 | v62.48,1.65 63.07,2.24 v64.26,2.24
  Bottom 0.381: v7.73,5.55 7.68,5.55 6.22,7.01 6.22,9.12 J3.SHLD3 3.69,9.4 | 42.04,5.08 43.81,5.08 | v48.33,5.52 48.2,5.39 LCD1.7 | C31.1 57.78,6.48 59.33,4.93 v61.85,4.93 | C31.1 56.13,6.6 54.02,6.6 U6.1 | C37.1 C31.1 | C39.1 53.34,7.67 U6.1 | U6.1 52.26,7.48 49.98,5.2 48.65,5.2
  Bottom 0.508: 6.98,8.54 6.98,9.4 | 6.98,1.62 6.98,0.76
  Bottom 0.61: v42.54,1.22 42.11,1.22 C26.2 | 48.65,5.2 v48.33,5.52 v48.33,4.88 48.65,5.2
  Bottom 0.8: S5.2 v80.65,7.37 | S5.2 85.73,7.37 85.73,7.38 | S5.1 S5.2
  Bottom 1.143: 6.68,9.32 6.66,9.3 1.13,9.3 | 6.68,0.84 6.66,0.86 1.13,0.86
  other vias: 38.61,5.46 72.39,5.08 76.84,3.56 81.66,2.79 81.79,5.08 81.79,7.37 80.65,2.79 12.32,0.71 12.95,1.35 0.76,5.08 3.3,5.08 3.3,6.6 2.03,5.84 2.03,4.32 0.76,3.56 2.03,2.79 2.03,7.37 3.3,3.56 3.3,2.03 4.57,4.32 4.57,5.84 3.3,8.13 49.35,2.98 48.58,2.47 72.39,7.49
  pour Bottom (no thermals): 42.42,2.67 42.42,4.57 42.93,5.08 42.42,5.59 42.42,7.49 42.29,7.62 41.78,7.62 41.66,7.49 41.66,6.35 41.15,5.84 38.23,5.84 37.08,4.7 36.32,4.7 35.88,5.14 35.69,4.95 35.69,3.43 35.81,3.3 36.7,3.3 36.83,3.43 41.48,3.48 41.66,3.3 41.66,2.67 41.78,2.54 42.29,2.54
  pour Bottom (rank 4): 68.07,10.16 68.07,0 81.28,0 81.28,1.52 82.17,2.41 82.17,7.75 81.28,8.64 81.28,10.16
  pour Bottom (rank 5, no thermals): 34.3,5.58 33.65,6.22 32.77,6.22 32.13,5.59 32.13,4.57 31.75,4.19 31.75,3.17 31.5,2.92 29.97,2.92 29.72,2.67 29.72,2.29 29.34,1.91 12.07,1.91 10.39,3.58 8.99,3.58 8.51,4.06 8.51,10.29 -0.13,10.29 -0.13,0 33.58,0 34.29,0.71 34.29,3.96
  pour Top (rank 5, no thermals): -0.51,10.41 11.43,10.41 11.43,-0.25 -0.51,-0.25
  pour Top (no thermals): 27.64,8.13 27.64,2.03 33.73,2.03 33.73,8.13
  pour Top: 76.58,10.67 76.58,-0.51 81.28,-0.51 81.28,1.52 82.17,2.41 82.17,7.75 81.28,8.64 81.28,10.67
  pour Top (no thermals): 46.1,5.59 46.48,5.97 48.51,5.97 48.77,5.72 48.77,4.7 49.66,3.81 49.66,3.05 49.91,2.79 49.91,2.67 49.15,1.91 49.15,0.76 48.89,0.51 47.75,0.51 47.5,0.76 47.5,3.94 47.12,4.32 46.35,4.32 46.1,4.57
  pour Top (no thermals): 56.39,0.89 56.39,5.59 56.2,5.78 55.56,5.78 55.56,2.41 53.97,2.41 53.72,2.16 53.72,1.91 54.1,1.52 54.1,0.89 54.36,0.63 56.13,0.63
  pour Top (no thermals): 52.58,6.6 52.58,7.18 52.45,7.3 51.69,7.3 51.59,7.2 51.59,4.55 51.69,4.45 52.45,4.45 52.55,4.55 52.55,5.31 52.9,5.65 53.59,5.65 53.59,6.29 52.9,6.29
  pour Bottom (no thermals): 23.75,8.25 23.75,8.51 24.26,9.02 24.26,9.52 25.4,9.52 25.59,9.72 25.4,9.91 21.72,9.91 21.4,9.59 21.4,8.19 21.59,8 23.5,8
  pour Top (no thermals): 12.19,4.7 11.94,4.45 11.94,0.51 12.19,0.25 14.73,0.25 14.99,0.51 14.99,3.43 14.86,3.56 13.84,3.56 13.21,4.19 13.21,4.45 12.95,4.7
  pour Bottom: 53.97,3.94 54.23,3.68 54.23,1.78 53.97,1.52 51.18,1.52 50.55,2.16 50.04,2.16 49.78,1.91 49.78,0.89 49.53,0.63 48.39,0.63 48.13,0.89 48.13,2.67 49.4,3.94
LDO_IN  (via drill 0.3)
  Top 0.61: v59.11,1.83 58.71,1.44 FB1.2
  Bottom 0.381: v59.11,1.83 59,1.93 59,3.74 58.21,4.53 56.68,4.53 C31.2 56.08,5.13 54.35,5.13 U6.3
N$1
  Top 0.127: VD1.4 13.53,5.65 | R5.1 13.84,5.97 13.53,5.65 | R4.1 16.32,4 15.62,4 14.92,4.7 R27.1 14.22,5.21 13.97,5.21 13.53,5.65
N$2  (1 unrouted)
  Bottom 0.127: S3.1 61.72,2.29 R7.2
N$3
  pour Bottom (no thermals): 16.38,5.33 15.11,5.33 14.86,5.08 14.86,1.91 21.72,1.91 22.48,2.67 22.48,3.76 22.3,3.94 20.57,3.94 20.19,3.56 18.16,3.56
N$4
  Bottom 0.178: LCD1.1 44.84,9.11 44.58,9.37 C21.1
N$5
  Bottom 0.127: R35.1 23.16,3.5 22.42,4.25 20.34,4.25 20.21,4.12 Q3.4 20.08,3.71 18.03,3.73 16.64,5.12 D3.A 16.64,5.33 15.75,6.22 R10.2 14.99,5.72 14.54,5.27 14.54,2.99 14.7,2.83 Q2.4
N$6
  Bottom 0.178: LCD1.3 46.16,7.97 44.65,7.97 44.24,8.38 41.82,8.38 40.79,9.41 C22.1
N$7  (via drill 0.3)
  Top 0.254: U3.9 76.43,6.33 76.71,6.6 76.71,8.76 77.09,9.14 C11.2
  Top 0.61: C11.2 v78.23,9.52
  Bottom 0.254: v78.23,9.52 78.58,9.18 FB2.1
N$8  (1 unrouted)
  Bottom 0.127: C3.1 76.2,0.89 76.58,1.27 77.09,1.27 77.98,2.16 S1.4 R9.2
N$11
  Bottom 0.178: LCD1.2 44.71,8.49 44.52,8.69 42.74,8.69 42.3,9.12 42.29,9.12 C21.2
N$12  (1 unrouted)
  Bottom 0.127: S2.4 65.41,7.62 C6.1 64.17,6.39 64.17,5.88 R14.2
N$13
  Bottom 0.178: LCD1.4 46.24,7.23 44.57,7.23 44.32,7.48 44.32,7.8 44.04,8.08 41.6,8.08 41.07,8.61 40,8.61 C22.2
N$14
  Bottom 0.254: LCD1.13 44.56,1.67 43.56,2.67 C25.1
N$15
  Bottom 0.254: LCD1.12 44.58,2.29 44.32,2.54 44.32,3.43 R17.2
N$16
  Bottom 0.254: LCD1.14 43.65,1.05 C26.1
N$17
  Bottom 0.254: Q4.1 30.97,4.61 R11.1
N$18
  Top 0.254: R2.2 56.77,5.97 | 56.77,5.97 56.77,4.32 57.02,4.06 C35.2 | U4.3 54.64,6.92 54.83,6.73 R1.2 56.77,5.97
N$19
  Bottom 0.203: Q4.3 28.49,2.67 28.11,2.29 26.72,2.29 C16.2
  Bottom 0.254: C16.2 25.2,3.05 R35.2
N$20
  Bottom 0.254: C17.1 31.62,6.48 31.62,6.1 31.33,5.8 30.64,5.8 R11.2 29.92,4.27 29.08,3.43 28.32,3.43 27.94,3.05 R12.2
N$21  (via drill 0.3)
  Top 0.254: FB3.1 v40.13,1.4
  Bottom 0.254: 40.45,1.08 AMP1.5
  Bottom 0.61: v40.13,1.4 40.45,1.08
N$22
  Top 0.127: VD1.6 13.53,7.55 | 13.53,7.55 13.84,7.24 R6.1 | R28.1 14.22,8 13.97,8 13.53,7.55
N$23
  Top 0.254: U1.2 38.99,3.56 37.97,2.54 37.38,2.54 FB5.1
N$24  (via drill 0.3)
  Top 0.127: U3.20 71.64,9.14 v71.25,9.52
  Bottom 0.254: v71.25,9.52 71,9.27 JP1.2
N$30
  Bottom 0.203: DA1.10 17.38,9.64 16.89,9.14 C1.1
  Bottom 0.254: C1.1 16.13,9.02 15.11,9.02 R36.1
N$32
  Bottom 0.203: DA1.9 17.77,9.14 C1.2
  Bottom 0.254: C1.2 R37.1
N$35
  Bottom 0.254: R41.2 76.84,8.64 74.17,5.97 72.11,5.97 U5.2
NRST  (via drill 0.3)
  Top 0.127: U3.7 v76.83,5.33 v76.84,5.33
  Bottom 0.254: v76.84,5.33 78.36,5.33 R23.1 C10.1 81.41,3.56 81.92,3.56 82.17,3.3 82.8,3.3 82.93,3.17 S5.4
  Bottom 0.8: S5.4 S5.3
OSC_IN
  Top 0.127: U3.5 76.95,4.33 77.22,4.06 C8.2 78.87,5.08 80.01,5.08 81.04,4.06 ZO1.3
OSC_OUT
  Top 0.127: ZO1.1 79.1,6.1 C9.2 77.85,5.46 77.09,4.7 76.65,4.7 76.53,4.83 U3.6
OUT  (via drill 0.3)
  Top 0.203: 44.32,2.16 42.93,2.16
  Top 0.254: R45.2 44.32,2.16 | 42.93,2.16 v42.8,2.03
  Bottom 0.254: C34.1 R44.1 36.51,1.08 AMP1.1 38.93,1.08 39.88,2.03 v42.8,2.03
PA2/ADC2  (via drill 0.3)
  Top 0.254: v75.82,9.52 75.82,7.9 U3.12
  Bottom 0.254: 75.56,9.27 R41.1
  Bottom 0.61: v75.82,9.52 75.56,9.27
PA3/T2C4  (via drill 0.3)
  Top 0.254: v74.3,9.52 74.8,9.52 75.14,9.19 U3.13
  Bottom 0.254: C17.2 34.67,6.22 34.67,3.92 34.07,3.32 34.07,1.94 34.45,1.56 34.45,0.57 34.65,0.38 60.35,0.38 60.81,0.84 60.81,3.42 61.1,3.71 61.84,3.71 62.18,3.37 64.82,3.37 65.33,3.87 66.52,3.87 66.93,4.28 66.93,4.55 67.34,4.96 67.34,5.32 67.68,5.66 70.57,5.66 71.5,6.59 71.5,7.61 72.13,8.24 73.09,8.24 74.3,9.45 v74.3,9.52
PA7/T1CH1N/T3C2  (via drill 0.3)
  Top 0.127: v10.41,3.99 10.41,4.47 9.97,4.91 8.59,4.91 8.08,4.39 v8.08,4.04 | v15.49,2.03 15.77,1.75 15.77,0.93 16.39,0.32 57.59,0.32 57.9,0.62 57.9,1.52 58.74,2.36 v59.71,2.36 | v73.53,9.52 73.14,9.13 U3.17
  Bottom 0.127: v8.08,4.04 5.93,4.04 5.18,4.79 5.18,6.31 4.42,7.08 BUZ1.+ | v10.41,3.99 10.67,3.73 10.67,3.43 12.19,1.91 15.37,1.91 v15.49,2.03 | v59.71,2.36 60.22,2.87 60.22,3.35 60.9,4.03 62.01,4.03 62.36,3.68 64.64,3.68 65.15,4.19 66.27,4.19 66.61,4.54 66.61,4.69 67.02,5.1 67.02,5.45 67.55,5.98 70.44,5.98 71.18,6.73 71.18,7.74 72,8.56 72.57,8.56 v73.53,9.52
PA8/SCL3  (via drill 0.3)
  Top 0.127: U1.6 40.51,5.33 41.15,5.97 R3.2 | R3.2 42.8,6.73 42.8,7.62 43.18,8 58.05,8 58.74,7.31 59.12,7.31 v59.69,7.87 | v62.48,7.49 61.85,6.86 61.86,6.86 U8.4 | v40.51,6.85 41.15,6.85 R3.2 | U3.29 68.32,5.83 66.62,7.53 66.21,7.53 65.02,8.71 65.02,9.09 v64.72,9.4
  Bottom 0.127: DA1.5 25.42,7.64 25.91,8.13 25.91,8.64 26.42,9.14 34.42,9.14 36.07,7.49 36.07,5.59 36.47,5.18 37.31,5.18 37.73,5.6 37.73,5.97 38.11,6.35 40.01,6.35 v40.51,6.85 | v59.69,7.87 60.58,8.76 61.84,8.76 62.19,8.42 62.19,7.78 v62.48,7.49 62.87,7.87 62.87,8.13 64.14,9.4 v64.72,9.4
PA10/IT_ACCEL_2  (via drill 0.3)
  Top 0.127: U8.9 61.36,3.06 61.65,2.77 v62.48,2.77 | v67.59,4.39 67.97,4.39 68.41,4.83 U3.31
  Bottom 0.127: v62.48,2.77 64.69,2.77 65.47,3.54 66.74,3.54 v67.59,4.39
PA11/USB_DM
  Top 0.127: U3.32 68.29,4.33 67.82,3.86 67.39,3.86 66.99,4.26 66.99,6.42 66.39,7.02 65.99,7.02 63.48,9.52 38.12,9.52 36.98,8.38 35.18,8.38 34.54,9.02 17.68,9.02 17.14,8.49 17.14,7.11 16.89,6.86 16.64,6.86 R6.2
PA12/USB_DP
  Top 0.127: R5.2 16.64,6.35 16.76,6.35 17.4,6.99 17.4,8.38 17.78,8.76 34.42,8.76 35.05,8.13 37.08,8.13 38.23,9.27 63.38,9.27 65.88,6.77 66.28,6.77 66.74,6.31 66.74,4.11 67.25,3.6 67.93,3.6 68.17,3.83 U3.33
PA13/SWDIO
  Top 0.127: R27.2 17.02,5.46 17.02,6.22 17.65,6.86 17.65,8.25 17.91,8.51 34.29,8.51 34.92,7.87 37.21,7.87 38.35,9.02 63.27,9.02 65.78,6.51 66.17,6.51 66.48,6.2 66.48,4 67.16,3.33 U3.34
PA14/SWCLK  (via drill 0.3)
  Top 0.127: U3.37 69.53,1.47 v68.78,1.47 | R28.2 17.02,9.27 34.67,9.27 35.31,8.64 36.83,8.64 37.97,9.78 63.59,9.78 66.09,7.27 66.49,7.27 67.24,6.52 67.24,5.76 v67.92,5.08
  Bottom 0.127: v67.92,5.08 68.23,4.76 68.23,2.76 68.48,2.51 68.48,1.78 v68.78,1.47
PB0/ADC8  (via drill 0.3)
  Top 0.254: R45.1 45.08,6.67 46.1,7.68 57.85,7.68 58.55,6.99 59.31,6.99 59.56,7.24 59.89,7.24 60.78,8.13 62.89,8.13 64.44,6.58 64.44,5.82 64.82,5.44 65.53,5.44 65.96,5 v65.96,4.75 | v72.77,9.52 72.64,9.39 U3.18
  Bottom 0.254: v72.77,9.52 72.77,9.45 72.21,8.89 71.88,8.89 70.87,7.87 70.87,6.86 70.31,6.3 67.42,6.3 66.7,5.58 66.7,5.33 66.12,4.75 v65.96,4.75
PB1/IT_FUSB302  (via drill 0.3)
  Top 0.127: R16.2 41.66,4.7 41.4,4.96 v40.97,4.96 40.84,4.96 40.71,4.83 U1.5 | v40.89,8 41.4,8.51 63.04,8.51 64.82,6.73 64.82,6.37 v65.18,6.02 | U3.19 72.14,9.39 v72.01,9.52
  Bottom 0.127: v40.89,8 41.35,7.54 41.35,6.35 40.97,5.97 v40.97,4.96 | v72.01,9.52 70.55,8.06 70.55,7 70.19,6.64 69.18,6.64 68.58,7.24 68.58,7.62 68.02,8.18 67.36,8.18 66.93,7.75 66.93,6.99 66.56,6.61 65.77,6.61 v65.18,6.02
PB4/SDA3  (via drill 0.3)
  Top 0.127: U1.7 40.2,6.28 39.75,6.73 v39.75,7.11 40.06,7.42 40.84,7.42 41.02,7.24 R25.2 43.05,8.25 58.55,8.25 v58.93,7.87 | v60.15,6.22 60.79,5.58 U8.6 60.7,5.58 60.32,5.21 60.32,4.45 60.9,3.87 60.9,3.06 61.76,2.2 63.13,2.2 63.58,1.75 63.58,1.44 64.19,0.83 70.67,0.83 71.13,1.28 U3.40
  Bottom 0.127: DA1.4 25.41,8.14 25.65,8.38 25.65,8.76 26.29,9.4 34.54,9.4 36.32,7.62 36.32,5.72 36.6,5.44 37.19,5.44 37.47,5.73 37.47,6.11 37.97,6.6 39.24,6.6 v39.75,7.11 | v58.93,7.87 58.93,7.44 v60.15,6.22
PB6/SCL1  (via drill 0.3)
  Top 0.127: U3.42 72.14,1.02 71.69,0.57 60.9,0.57 60.58,0.89 60.58,1.37 v60.22,1.73
  Bottom 0.127: LCD1.10 48.23,3.53 49.15,4.45 54.36,4.45 54.66,4.14 55.55,4.14 R19.1 56.9,4.06 58.01,4.06 58.57,3.5 58.57,1.63 58.98,1.22 59.33,1.22 59.84,1.73 v60.22,1.73
PB7/SDA1  (via drill 0.3)
  Top 0.127: U3.43 72.64,1.01 71.95,0.32 60.67,0.32 v60.02,0.96
  Bottom 0.127: v60.02,0.96 58.85,0.96 58.32,1.5 58.32,3.4 58.07,3.64 57.11,3.64 56.92,3.45 56.92,2.95 56.64,2.67 55.75,2.67 R18.1 54.23,4.19 49.25,4.19 47.97,2.91 LCD1.11
PB8&BOOT0_S3  (via drill 0.3)
  Top 0.152: U3.45 73.66,1.56 73.66,0.76 73.51,0.61 v73.15,0.61 73.14,0.62 U3.44
  Bottom 0.127: v73.15,0.61 72.54,0.61 72.44,0.51 68.35,0.51 67.57,1.29 67.57,1.61 67.27,1.92 66.84,1.92 66.48,1.55 65.18,1.55 R8.1 R7.1
PB9/S1  (via drill 0.3)
  Top 0.127: U3.46 74.14,1.04 74.8,0.38 75.95,0.38 76.2,0.63 v76.71,0.63
  Bottom 0.127: R9.1 77.72,1.02 77.34,0.63 v76.71,0.63
PB13/IT_INA226  (via drill 0.3)
  Top 0.127: v40.13,8 40.89,8.76 63.17,8.76 65.91,6.02 65.92,6.02 v65.94,5.99 | U3.26 68.39,7.33 68.07,7.65 v67.64,7.65
  Bottom 0.127: v40.13,8 41.1,7.04 41.1,6.55 40.64,6.1 38.24,6.1 37.98,5.84 37.98,5.47 37.44,4.93 36.35,4.93 35.81,5.46 35.81,7.37 34.29,8.89 27.33,8.89 R38.2 25.68,7.24 24.26,7.24 24,7.49 24,8.38 24.26,8.64 DA1.3 | v67.64,7.65 67.3,7.31 67.3,6.99 66.66,6.35 66.29,6.35 v65.94,5.99
PB15/S2  (via drill 0.3)
  Top 0.127: U3.28 68.55,6.33 v67.95,6.93
  Bottom 0.127: v67.95,6.93 67.62,6.61 67.28,6.61 66.39,5.72 66.39,5.47 66.19,5.27 65.09,5.27 R14.1
PGND  (via drill 0.3, 3.05 pad 4.89, 3.3)  (1 unrouted)
  other vias: 43.23,14.86 86.58,14.86 46.53,16.86 46.53,14.86 46.53,12.86 48.53,16.86 48.53,14.86 48.53,12.86 83.43,16.86 83.43,14.86 83.43,12.86 81.83,15.86 81.83,13.86 80.03,14.86 50.53,16.86 50.53,14.86 50.53,12.86 76.53,16.86 76.53,14.86 76.53,12.86
  pour Top (no thermals): 82.93,8.13 82.93,2.03 89.03,2.03 89.03,8.13
  pour Bottom (no thermals): 82.93,8.13 82.93,2.03 89.03,2.03 89.03,8.13
  pour Top: 90.73,17.36 90.73,12.36 39.73,12.36 39.73,17.36
  pour Bottom: 90.73,17.36 90.73,12.36 39.73,12.36 39.73,17.36
RES_3.3V  (via drill 0.3)
  Top 0.254: R22.1 61.37,2.01 C7.1
  Top 0.61: v59.74,4.04 60.07,3.71 R22.1
  Bottom 0.203: 50.29,4.83 50.2,4.83 50.12,4.74 49.03,4.74 48.44,4.15 LCD1.9 | 56.9,5.72 55.63,5.72
  Bottom 0.254: v59.74,4.04 59.46,4.32 59.18,4.32 58.42,5.08 57.53,5.08 56.9,5.72 | 50.29,4.83 52.2,4.83 53.53,6.16 55.18,6.16 55.63,5.72
SW
  Top 0.508: C29.2 54.4,3.51 L1.1 50.42,3.51 50.37,3.56 D7.C 50.3,4.93 50.39,5.02 U4.6
T12+  (via drill 0.3)
  Top 0.254: v26.92,6.48 25.91,6.48 25.02,7.37 D9.C
  Top 0.8: D9.C 23.47,7.37 PAD2.TP | PAD4.TP 23.47,2.79 R13.1
  Bottom 0.254: C27.1 25.2,5.08 T1.1B | R42.2 27.41,6.96 v26.92,6.48
  pour Bottom (rank 2, no thermals): 17.53,4.57 17.53,5.72 18.41,6.6 19.81,6.6 20.45,7.24 23.11,7.24 24.89,5.46 24.89,4.57 24.26,3.94 23.24,3.94 22.61,4.57 20.19,4.57 19.56,3.94 18.16,3.94
  pour Top (no thermals): 18.14,8.13 18.14,2.03 24.23,2.03 24.23,8.13
VBUS-C  (via drill 0.3)
  Top 0.254: D1.A 46.11,1.1 45.65,0.63 38.42,0.63 38.04,1.02 37.38,1.02 FB5.2
  Top 0.381: v13.84,4.19 14.16,3.87 15.18,3.87 16.18,2.87 16.18,1.09 16.57,0.7 36.39,0.7 36.7,1.02 37.3,1.02 FB5.2
  Top 0.61: v13.84,4.19 13.46,4.57 v13.46,4.7
  Bottom 0.203: R37.2 12.83,7.62 12.57,7.37 11.81,7.37 11.68,7.24 R24.1
  Bottom 0.254: v13.84,4.19 13.84,3.94 Q2.9
  Bottom 0.381: v13.46,4.7 13.38,4.79 Q2.8
  pour Bottom (no thermals): 11,6.99 10.92,6.91 10.92,3.56 12.32,2.16 13.89,2.16 14.22,2.49 14.22,6.35 13.97,6.6 12.83,6.6 12.45,6.99
VCAP1
  Top 0.203: U3.22 70.64,9.24 70.1,9.78 68.58,9.78 68.2,9.4 C32.1
VUSB_IN  (via drill 0.3)
  Bottom 0.203: 13.97,9.7 14.25,9.42 14.25,7.17 14.5,6.92 16.9,6.92 | R36.2 12.45,7.87 11.81,7.87 11.68,8 R24.2
  Bottom 0.254: DA1.8 17.78,8.64 17.02,7.87 17.02,7.04 16.9,6.92 | 13.97,9.7 12.62,9.7
  other vias: 9.7,4.37 9.27,3.94 8.76,7.11 8.26,6.86 7.75,7.11 8.84,4.37
  pour Top (rank 2, no thermals): 11.3,-0.51 11.3,5.08 7.62,5.08 7.62,3.33 7.25,2.95 6.1,2.95 6.1,2.41 7.14,2.41 7.62,1.93 7.62,-0.51
  pour Top (no thermals): 9.4,7.49 7.75,7.49 7.42,7.82 6.05,7.82 6.05,6.1 8.64,6.1 9.4,6.86
  pour Bottom (no thermals): 7.49,10.29 7.49,6.73 8.38,5.84 8.38,4.45 9.14,3.68 10.67,3.68 10.67,7.11 10.92,7.37 10.92,8.13 11.1,8.31 12.42,8.31 12.7,8.59 12.7,9.42 12.75,9.42 13.03,9.7 12.45,10.29

### Text on the board
tPlace: PGND Connnector | JLCJLCJLCJLC | + | - | PGND | v1.0 | F4x1
bPlace: OldGerman | JP1 | 1mm | R | REF | T | Buzzer | REF | 3 | 2 | 1 | 2021/04 | FPC | v1.0 | RST | OLED
tDocu: OldGerman
TS100_SIZE: handle: | ALL:
200bmp: OldGerman 2020/12